# Altium project pajongji_v2.PrjPcb
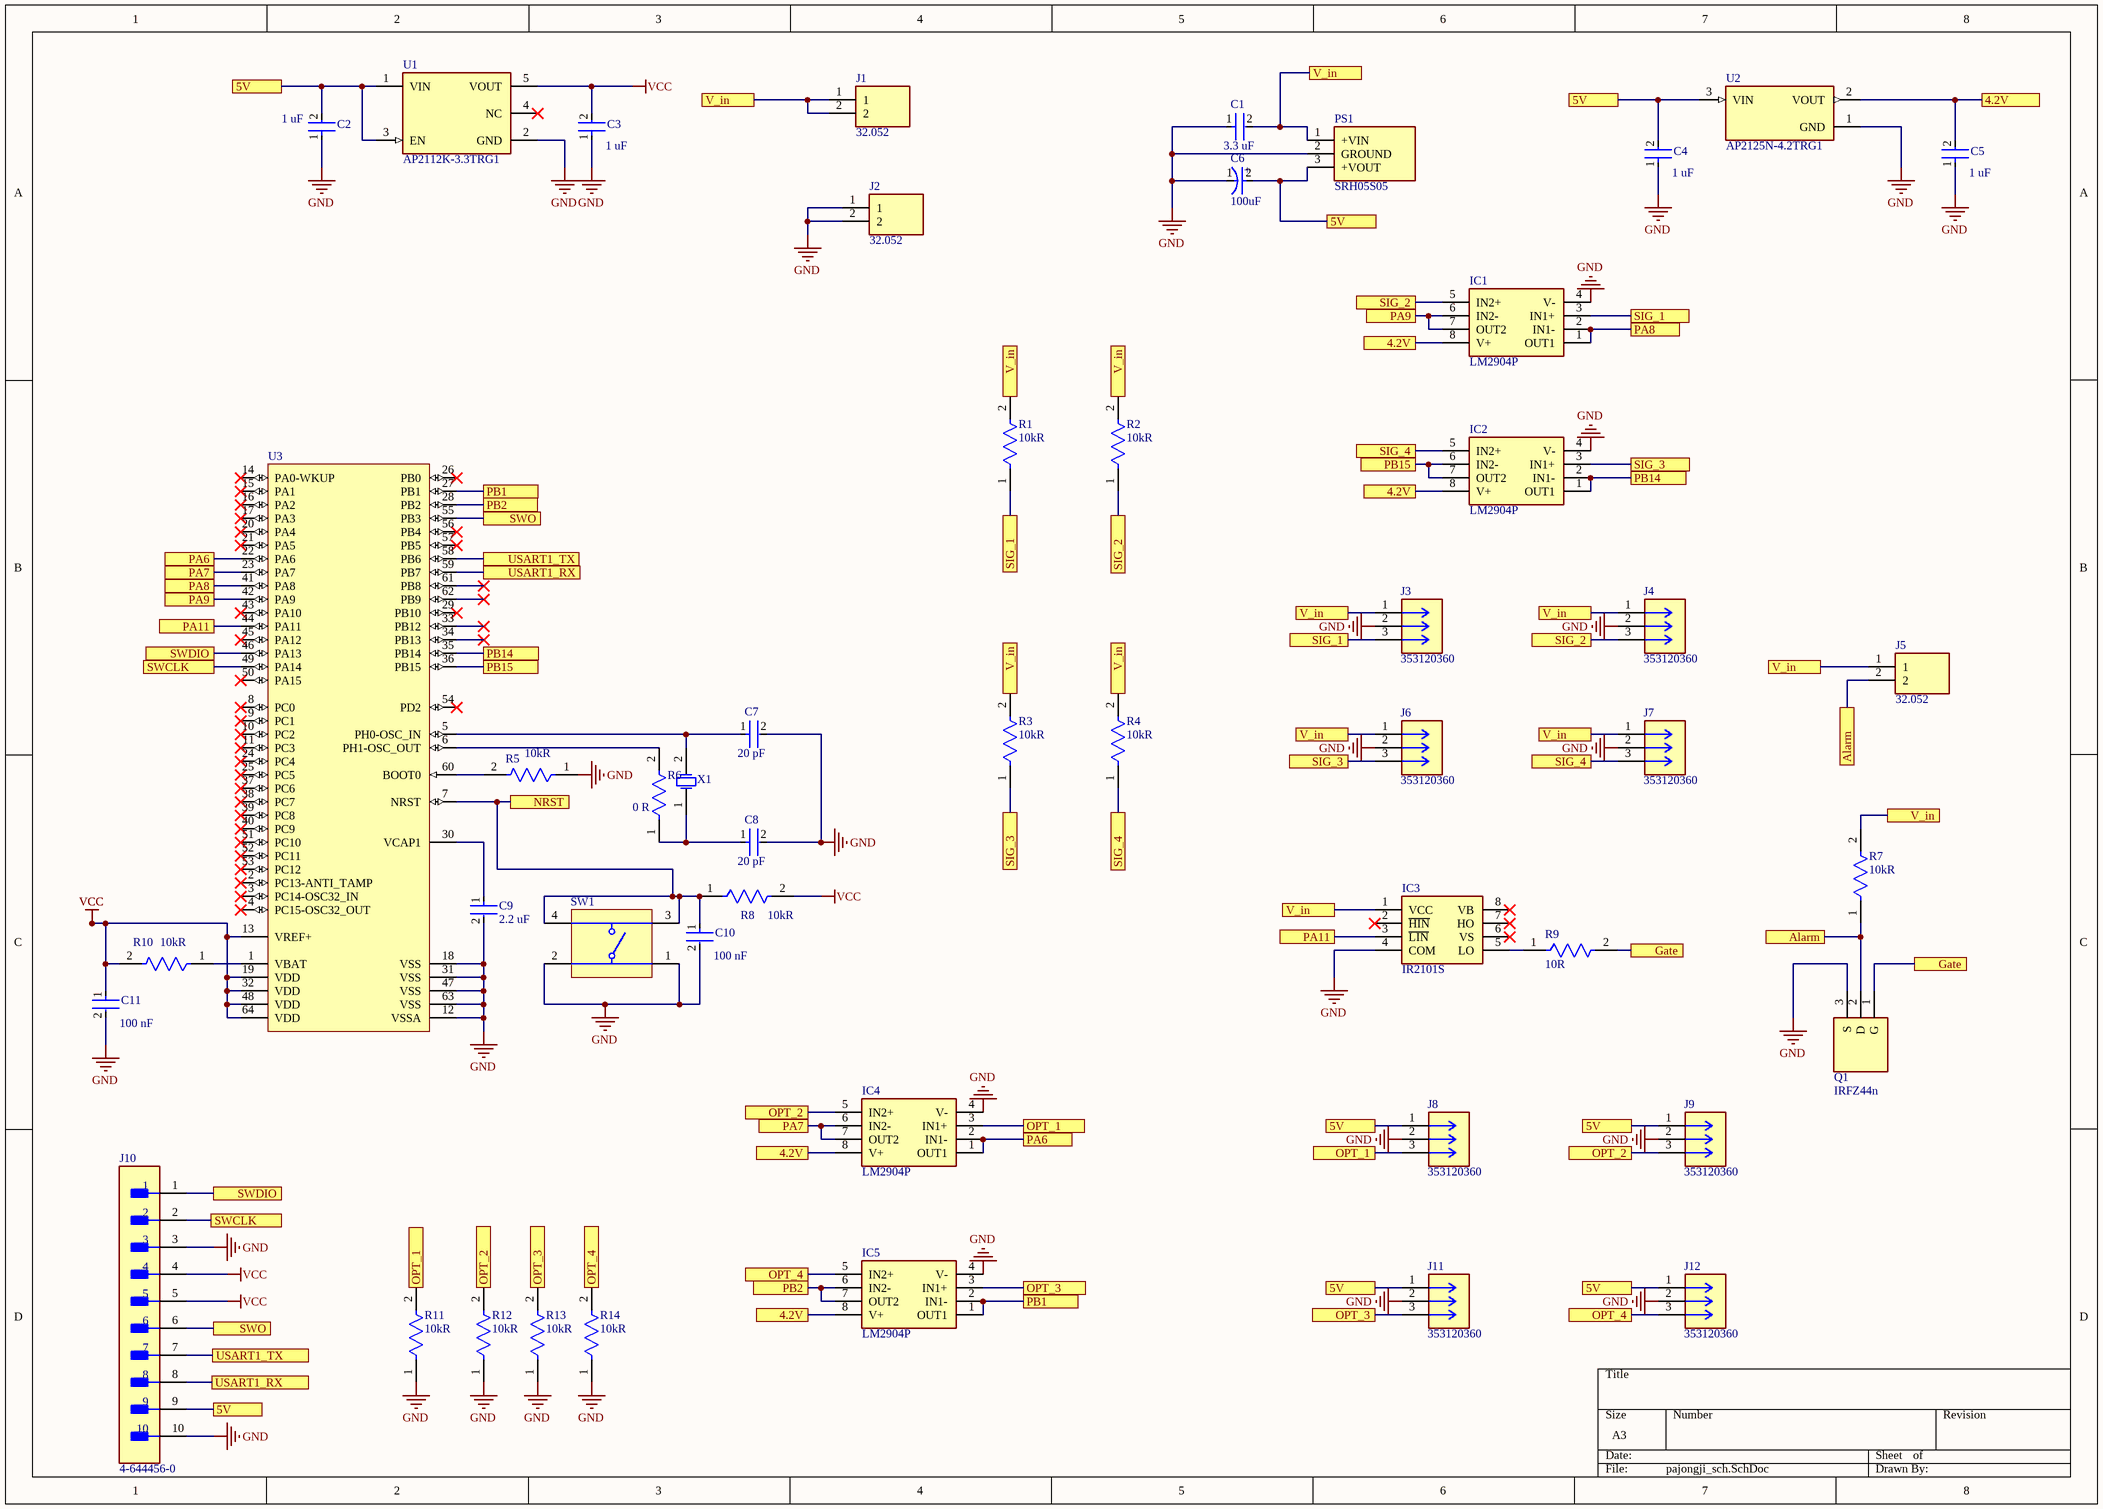
[diagram p0: pajongji_sch.SchDoc]
1 sheet, 49 parts. Net scope: flat (ports and power ports of the same name join across sheets).
Board file: PCB4.PcbDoc

## Sheet pajongji_sch.SchDoc
size A3; SheetNumber: 1; SheetTotal: 1

### Parts
C1  value 3.3 uF  [FP-CC0603-DA-MFG]  (hidden comment: CC0603KRX7R9BB103)
C2  value 1 uF  [FP-CC0603-DA-MFG]  (hidden comment: CC0603KRX7R9BB103)
C3  value 1 uF  [FP-CC0603-DA-MFG]  (hidden comment: CC0603KRX7R9BB103)
C4  value 1 uF  [FP-CC0603-DA-MFG]  (hidden comment: CC0603KRX7R9BB103)
C5  value 1 uF  [FP-CC0603-DA-MFG]  (hidden comment: CC0603KRX7R9BB103)
C6  100uF  [FP-RAD-TH-D_5_0_5-L_11_1-MFG]
C7  value 20 pF  [FP-CC0603-DA-MFG]  (hidden comment: CC0603KRX7R9BB103)
C8  value 20 pF  [FP-CC0603-DA-MFG]  (hidden comment: CC0603KRX7R9BB103)
C9  value 2.2 uF  [FP-CC0603-DA-MFG]  (hidden comment: CC0603KRX7R9BB103)
C10  Capacitance: 100 nF  [FP-CC0603-DA-MFG]  (hidden comment: CC0603KRX7R9BB104)
C11  Capacitance: 100 nF  [FP-CC0603-DA-MFG]  (hidden comment: CC0603KRX7R9BB104)
IC1  LM2904P  [DIP794W53P254L959H508Q8N]
IC2  LM2904P  [DIP794W53P254L959H508Q8N]
IC3  IR2101S  [SOIC127P600X175-8N]
IC4  LM2904P  [DIP794W53P254L959H508Q8N]
IC5  LM2904P  [DIP794W53P254L959H508Q8N]
J1  32.052  [SHDR2W100P0X508_1X2_1076X900X1350P]
J2  32.052  [SHDR2W100P0X508_1X2_1076X900X1350P]
J3  353120360  [CONN_35312-0360_MOL]
J4  353120360  [CONN_35312-0360_MOL]
J5  32.052  [SHDR2W100P0X508_1X2_1076X900X1350P]
J6  353120360  [CONN_35312-0360_MOL]
J7  353120360  [CONN_35312-0360_MOL]
J8  353120360  [CONN_35312-0360_MOL]
J9  353120360  [CONN_35312-0360_MOL]
J10  4-644456-0  [FP-4-644456-0-MFG]
J11  353120360  [CONN_35312-0360_MOL]
J12  353120360  [CONN_35312-0360_MOL]
PS1  SRH05S05  [SRH05S05]
Q1  IRFZ44n  [TO254P483X1016X2223-3P]
R1  Resistance: 10kR  [FP-CR0603-AS-MFG]  (hidden comment: CR0603-FX-1002EAS)
R2  Resistance: 10kR  [FP-CR0603-AS-MFG]  (hidden comment: CR0603-FX-1002EAS)
R3  Resistance: 10kR  [FP-CR0603-AS-MFG]  (hidden comment: CR0603-FX-1002EAS)
R4  Resistance: 10kR  [FP-CR0603-AS-MFG]  (hidden comment: CR0603-FX-1002EAS)
R5  Resistance: 10kR  [FP-CR0603-AS-MFG]  (hidden comment: CR0603-FX-1002EAS)
R6  Resistance: 0 R  [FP-CR0603-AS-MFG]  (hidden comment: CR0603-FX-1002EAS)
R7  Resistance: 10kR  [FP-CR0603-AS-MFG]  (hidden comment: CR0603-FX-1002EAS)
R8  Resistance: 10kR  [FP-CR0603-AS-MFG]  (hidden comment: CR0603-FX-1002EAS)
R9  Resistance: 10R  [FP-CR0603-AS-MFG]  (hidden comment: CR0603-FX-1002EAS)
R10  Resistance: 10kR  [FP-CR0603-AS-MFG]  (hidden comment: CR0603-FX-1002EAS)
R11  Resistance: 10kR  [FP-CR0603-AS-MFG]  (hidden comment: CR0603-FX-1002EAS)
R12  Resistance: 10kR  [FP-CR0603-AS-MFG]  (hidden comment: CR0603-FX-1002EAS)
R13  Resistance: 10kR  [FP-CR0603-AS-MFG]  (hidden comment: CR0603-FX-1002EAS)
R14  Resistance: 10kR  [FP-CR0603-AS-MFG]  (hidden comment: CR0603-FX-1002EAS)
SW1  FSM4JSMATR  [TECO-FSM4JSMATR_V]  (value not drawn)
U1  AP2112K-3.3TRG1  [FP-SOT25-IPC_A]
U2  AP2125N-4.2TRG1  [SOT95P282X145-3N]
U3  STM32F411RET6  [STM-LQFP64_L]  (value not drawn)
X1  FOXSDLF/160-20  [FOX-FOXSDLF160-20_V]  (value not drawn)

### Ports
4.2V (see pajongji_sch[3D], pajongji_sch[6A], pajongji_sch[6B]), 4.2V (see pajongji_sch[3D], pajongji_sch[6A], pajongji_sch[6B], pajongji_sch[8A]), 4.2V (see pajongji_sch[3D], pajongji_sch[6A], pajongji_sch[8A]), 4.2V (see pajongji_sch[3D], pajongji_sch[6B], pajongji_sch[8A]), 5V (see pajongji_sch[1A], pajongji_sch[1D], pajongji_sch[6A], pajongji_sch[6C], pajongji_sch[6D], pajongji_sch[7C]), 5V (see pajongji_sch[1A], pajongji_sch[1D], pajongji_sch[6A], pajongji_sch[6C], pajongji_sch[6D], pajongji_sch[7C], pajongji_sch[7D]), 5V (see pajongji_sch[1A], pajongji_sch[1D], pajongji_sch[6A], pajongji_sch[6C], pajongji_sch[6D], pajongji_sch[7D]), 5V (see pajongji_sch[1A], pajongji_sch[1D], pajongji_sch[6A], pajongji_sch[6C], pajongji_sch[7C], pajongji_sch[7D]), 5V (see pajongji_sch[1A], pajongji_sch[1D], pajongji_sch[6A], pajongji_sch[6D], pajongji_sch[7C], pajongji_sch[7D]), 5V (see pajongji_sch[1A], pajongji_sch[6A], pajongji_sch[6C], pajongji_sch[6D], pajongji_sch[7C], pajongji_sch[7D]), 5V (see pajongji_sch[1D], pajongji_sch[6A], pajongji_sch[6C], pajongji_sch[6D], pajongji_sch[7C], pajongji_sch[7D]), Alarm (see pajongji_sch[7C]), Alarm (see pajongji_sch[8C]), Gate (see pajongji_sch[7C]), Gate (see pajongji_sch[8C]), NRST, OPT_1 (see pajongji_sch[2D], pajongji_sch[4C]), OPT_1 (see pajongji_sch[2D], pajongji_sch[6D]), OPT_1 (see pajongji_sch[4C], pajongji_sch[6D]), OPT_2 (see pajongji_sch[2D], pajongji_sch[3C]), OPT_2 (see pajongji_sch[2D], pajongji_sch[6D]), OPT_2 (see pajongji_sch[3C], pajongji_sch[6D]), OPT_3 (see pajongji_sch[3D], pajongji_sch[4D]), OPT_3 (see pajongji_sch[3D], pajongji_sch[5D]), OPT_3 (see pajongji_sch[4D], pajongji_sch[5D]), OPT_4 (see pajongji_sch[3D]), OPT_4 (see pajongji_sch[3D], pajongji_sch[6D]), PA6 (see pajongji_sch[1B]), PA6 (see pajongji_sch[4D]), PA7 (see pajongji_sch[1B]), PA7 (see pajongji_sch[3C]), PA8 (see pajongji_sch[1B]), PA8 (see pajongji_sch[7A]), PA9 (see pajongji_sch[1B]), PA9 (see pajongji_sch[6A]), PA11 (see pajongji_sch[1B]), PA11 (see pajongji_sch[5C]), PB1 (see pajongji_sch[2B]), PB1 (see pajongji_sch[4D]), PB2 (see pajongji_sch[2B]), PB2 (see pajongji_sch[3D]), PB14 (see pajongji_sch[2B]), PB14 (see pajongji_sch[7B]), PB15 (see pajongji_sch[2B]), PB15 (see pajongji_sch[6B]), SIG_1 (see pajongji_sch[4B], pajongji_sch[5B]), SIG_1 (see pajongji_sch[4B], pajongji_sch[7A]), SIG_1 (see pajongji_sch[5B], pajongji_sch[7A]), SIG_2 (see pajongji_sch[5B], pajongji_sch[6A]), SIG_2 (see pajongji_sch[5B], pajongji_sch[6B]), SIG_2 (see pajongji_sch[6A], pajongji_sch[6B]), SIG_3 (see pajongji_sch[4C], pajongji_sch[5C]), SIG_3 (see pajongji_sch[4C], pajongji_sch[7B]), SIG_3 (see pajongji_sch[5C], pajongji_sch[7B]), SIG_4 (see pajongji_sch[5C], pajongji_sch[6B]), SIG_4 (see pajongji_sch[5C], pajongji_sch[6C]), SIG_4 (see pajongji_sch[6B], pajongji_sch[6C]), SWCLK (see pajongji_sch[1B]), SWCLK (see pajongji_sch[1D]), SWDIO (see pajongji_sch[1B]), SWDIO (see pajongji_sch[1D]), SWO (see pajongji_sch[1D]), SWO (see pajongji_sch[2B]), USART1_RX (see pajongji_sch[1D]), USART1_RX (see pajongji_sch[2B]), USART1_TX (see pajongji_sch[1D]), USART1_TX (see pajongji_sch[2B]), V_in (see pajongji_sch[3A], pajongji_sch[4B], pajongji_sch[5A], pajongji_sch[5B], pajongji_sch[5C], pajongji_sch[6B], pajongji_sch[7B]), V_in (see pajongji_sch[3A], pajongji_sch[4B], pajongji_sch[5A], pajongji_sch[5B], pajongji_sch[5C], pajongji_sch[6B], pajongji_sch[7B], pajongji_sch[8C]), V_in (see pajongji_sch[3A], pajongji_sch[4B], pajongji_sch[5A], pajongji_sch[5B], pajongji_sch[5C], pajongji_sch[6B], pajongji_sch[8C]), V_in (see pajongji_sch[3A], pajongji_sch[4B], pajongji_sch[5A], pajongji_sch[5B], pajongji_sch[6B], pajongji_sch[7B], pajongji_sch[8C]), V_in (see pajongji_sch[3A], pajongji_sch[4B], pajongji_sch[5B], pajongji_sch[5C], pajongji_sch[6B], pajongji_sch[7B], pajongji_sch[8C]), V_in (see pajongji_sch[4B], pajongji_sch[5A], pajongji_sch[5B], pajongji_sch[5C], pajongji_sch[6B], pajongji_sch[7B], pajongji_sch[8C])

### Nets
GND: C1.1 C2.1 C3.1 C4.1 C5.1 C6.1(C) C7.2 C8.2 C9.2 C10.2 C11.2 IC1.4(V-) IC2.4(V-) IC3.4(COM) IC4.4(V-) IC5.4(V-) J2.1 J2.2 J3.2 J4.2 J6.2 J7.2 J8.2 J9.2 J10.3 J10.10 J11.2 J12.2 PS1.2(GROUND) Q1.3(S) R5.1 R11.1 R12.1 R13.1 R14.1 SW1.1 SW1.2 U1.2(GND) U2.1(GND) U3.12(VSSA) U3.18(VSS) U3.31(VSS) U3.47(VSS) U3.63(VSS)
VCC: C3.2 C11.1 J10.4 J10.5 R8.2 R10.2 U1.5(VOUT) U3.13(VREF+) U3.19(VDD) U3.32(VDD) U3.48(VDD) U3.64(VDD)
NetC1_2: C1.2 IC3.1(VCC) J1.1 J1.2 J3.1 J4.1 J5.1 J6.1 J7.1 PS1.1(+VIN) R1.2 R2.2 R3.2 R4.2 R7.2 ; port V_in
NetC2_2: C2.2 C4.2 C6.2(A) J8.1 J9.1 J10.9 J11.1 J12.1 PS1.3(+VOUT) U1.1(VIN) U1.3(EN) U2.3(VIN) ; port 5V
NetC5_2: C5.2 IC1.8(V+) IC2.8(V+) IC4.8(V+) IC5.8(V+) U2.2(VOUT) ; port 4.2V
NetC7_1: C7.1 U3.5(PH0-OSC_IN) X1.2(X2)
NetC8_1: C8.1 R6.1 X1.1(X1)
NetC9_1: C9.1 U3.30(VCAP1)
NetC10_1: C10.1 R8.1 SW1.3 SW1.4 U3.7(NRST) ; port NRST
NetIC1_1: IC1.1(OUT1) IC1.2(IN1-) U3.41(PA8) ; port PA8
NetIC1_3: IC1.3(IN1+) J3.3 R1.1 ; port SIG_1
NetIC1_5: IC1.5(IN2+) J4.3 R2.1 ; port SIG_2
NetIC1_6: IC1.6(IN2-) IC1.7(OUT2) U3.42(PA9) ; port PA9
NetIC2_1: IC2.1(OUT1) IC2.2(IN1-) U3.35(PB14) ; port PB14
NetIC2_3: IC2.3(IN1+) J6.3 R3.1 ; port SIG_3
NetIC2_5: IC2.5(IN2+) J7.3 R4.1 ; port SIG_4
NetIC2_6: IC2.6(IN2-) IC2.7(OUT2) U3.36(PB15) ; port PB15
NetIC3_3: IC3.3(~{LIN}) U3.44(PA11) ; port PA11
NetIC3_5: IC3.5(LO) R9.1
NetIC4_1: IC4.1(OUT1) IC4.2(IN1-) U3.22(PA6) ; port PA6
NetIC4_3: IC4.3(IN1+) J8.3 R11.2 ; port OPT_1
NetIC4_5: IC4.5(IN2+) J9.3 R12.2 ; port OPT_2
NetIC4_6: IC4.6(IN2-) IC4.7(OUT2) U3.23(PA7) ; port PA7
NetIC5_1: IC5.1(OUT1) IC5.2(IN1-) U3.27(PB1) ; port PB1
NetIC5_3: IC5.3(IN1+) J11.3 R13.2 ; port OPT_3
NetIC5_5: IC5.5(IN2+) J12.3 R14.2 ; port OPT_4
NetIC5_6: IC5.6(IN2-) IC5.7(OUT2) U3.28(PB2) ; port PB2
NetJ5_2: J5.2 Q1.2(D) R7.1 ; port Alarm
NetJ10_1: J10.1 U3.46(PA13) ; port SWDIO
NetJ10_2: J10.2 U3.49(PA14) ; port SWCLK
NetJ10_6: J10.6 U3.55(PB3) ; port SWO
NetJ10_7: J10.7 U3.58(PB6) ; port USART1_TX
NetJ10_8: J10.8 U3.59(PB7) ; port USART1_RX
NetQ1_1: Q1.1(G) R9.2 ; port Gate
NetR5_2: R5.2 U3.60(BOOT0)
NetR6_2: R6.2 U3.6(PH1-OSC_OUT)
NetR10_1: R10.1 U3.1(VBAT)

Not connected (* = marked no-connect by the designer): IC3 2(~{HIN})* 6(VS)* 7(HO)* 8(VB)*; U1 4(NC)*; U3 2(PC13-ANTI_TAMP)* 3(PC14-OSC32_IN)* 4(PC15-OSC32_OUT)* 8(PC0)* 9(PC1)* 10(PC2)* 11(PC3)* 14(PA0-WKUP)* 15(PA1)* 16(PA2)* 17(PA3)* 20(PA4)* 21(PA5)* 24(PC4)* 25(PC5)* 26(PB0)* 29(PB10)* 33(PB12)* 34(PB13)* 37(PC6)* 38(PC7)* 39(PC8)* 40(PC9)* 43(PA10)* 45(PA12)* 50(PA15)* 51(PC10)* 52(PC11)* 53(PC12)* 54(PD2)* 56(PB4)* 57(PB5)* 61(PB8)* 62(PB9)*

### Notes on the sheet
- (in symbol CMP-05427-001055-1) +

### Library data of the parts
C1-C5 C7-C9 = CMP-2100-03600-2: CAP CER 10000PF 50V X7R 0603; Manufacturer: YAGEO; Tolerance: 0.1; Material: Ceramic; Temperature Coefficient: 15%; Capacitance: 10 nF; Mouser Description: Multilayer Ceramic Capacitor, CC Series, 0.01 - F, - 10%, X7R, 50 V, 0603 [1608 Metric]; Digikey Description: CAP CER 10000PF 50V X7R 0603; Height: 0.9mm; Category: Cap; Temperature Characteristic: X7R; Footprint Url: http://www.yageo.com/exep/pages/download/literatures/UPY-C_GEN_24.pdf; Lead Free: Yes; Voltage Rating: 50 V; Manufacturer Part Number: CC0603KRX7R9BB103; Temperature: -55°C to +125°C; Device Class L3: Ceramic Capacitors; ComponentLink2Description: Datasheet; Voltage: 50 V; Package: CC0603-DA; Octopart: https://octopart.com/cc0603krx7r9bb103-yageo-192938; Automotive: No; Temperature Range High: +125°C; Temperature Range Low: -55°C; RoHS: TRUE; Device Class L1: Passive Components; ComponentLink2URL: http://www.yageo.com/documents/recent/UPY-GPHC_X7R_6.3V-to-50V_18.pdf; Device Class L2: Capacitors
C6 = CMP-05427-001055-1: Aluminum Electrolytic Capacitors (Radial Lead Type) 33uF ±20% 35V
C10 C11 = CMP-2100-03601-2: CAP CER 0.1UF 50V X7R 0603; Manufacturer: YAGEO; Material: Ceramic; Temperature Coefficient: 15%; Tolerance: 0.1; Value: 100 nF; Height: 0.9mm; Voltage: 50 V; ComponentLink2Description: Datasheet; Device Class L2: Capacitors; Temperature Range High: +125°C; Category: Cap; Footprint Url: http://www.yageo.com/exep/pages/download/literatures/UPY-C_GEN_24.pdf; ComponentLink2URL: http://www.yageo.com/documents/recent/UPY-GPHC_X7R_6.3V-to-50V_18.pdf; Package: CC0603-DA; Temperature: -55°C to +125°C; Voltage Rating: 50 V; Temperature Characteristic: X7R; Device Class L1: Passive Components; Temperature Range Low: -55°C; Manufacturer Part Number: CC0603KRX7R9BB104; RoHS: TRUE; Automotive: No; Device Class L3: Ceramic Capacitors; Octopart: https://octopart.com/cc0603krx7r9bb104-yageo-42244635; Mouser Description: Multilayer Ceramic Capacitor, CC Series, 0.1 - F, - 10%, X7R, 50 V, 0603 [1608 Metric]; Lead Free: Yes; Digikey Description: CAP CER 0.1UF 50V X7R 0603
IC1 IC2 IC4 IC5 = LM2904P: Integrated Circuit; Manufacturer_Name: Texas Instruments; Datasheet Link: http://www.ti.com/lit/ds/symlink/lm2904.pdf; Height: 5.08mm; Manufacturer_Part_Number: LM2904P; Mouser Part Number: 595-LM2904P; Mouser Price/Stock: https://www.mouser.co.uk/ProductDetail/Texas-Instruments/LM2904P?qs=3pnr37ZAbK%252BRjjWgaCXbYA%3D%3D; Arrow Part Number: LM2904P; Arrow Price/Stock: https://www.arrow.com/en/products/lm2904p/texas-instruments?utm_currency=USD&region=europe
IC3 = IR2101S: Integrated Circuit; Manufacturer_Name: Infineon; Datasheet Link: https://pdf1.alldatasheet.com/datasheet-pdf/view/102221/IRF/IR2101S.html; Height: 1.75mm; Manufacturer_Part_Number: IR2101S
J1 J2 J5 = 32.052: Connector; Manufacturer_Name: Altech; Datasheet Link: https://www.mouser.com/datasheet/2/16/PCBUS-32235.pdf; Height: 13.5mm; Manufacturer_Part_Number: 32.052; Mouser Part Number: 845-32.052; Mouser Price/Stock: https://www.mouser.co.uk/ProductDetail/Altech/32.052?qs=3W%2FV3E1N0K7DFKJl2BNhnQ%3D%3D
J10 = CMP-03369-000038-1: CONN HEADER VERT 10POS 2.54MM; Manufacturer: TE Connectivity; Current Rating: 5A; Conn Gender: Male; Number Of Contacts: 10; Conn Orientation: Vertical; Voltage Rating: 250V; Number Of Rows: 1; Device Class L3: unset; Octopart: https://octopart.com/4-644456-0-te+connectivity-39514173; Pitch: 2.54mm; Mouser Description: Headers & Wire Housings NARROW FLT HDR 10P Straight Post; ComponentLink2Description: Datasheet; Height: 0.408inch; Package: 4-644456-0; RoHS: TRUE; Temperature Range High: +105°C; Digikey Description: CONN HEADER VERT 10POS 2.54MM; Temperature: -55°C to +105°C; Device Class L2: Headers and Wire Housings; Automotive: No; Lead Free: Yes; Contact Material: Tin; Manufacturer Part Number: 4-644456-0; Temperature Range Low: -55°C; Footprint Url: https://www.te.com/commerce/DocumentDelivery/DDEController?Action=showdoc&DocId=Customer+Drawing%7F644456%7FD2%7Fpdf%7FEnglish%7FENG_CD_644456_D2.pdf%7F4-644456-0; Device Class L1: Connectors; Category: Conn; ComponentLink2URL: https://www.te.com/commerce/DocumentDelivery/DDEController?Action=showdoc&DocId=Data+Sheet%7F82056_MTA%7F0818%7Fpdf%7FEnglish%7FENG_DS_82056_MTA_0818.pdf%7F4-644456-0
PS1 = SRH05S05: Power Supply; Manufacturer_Name: XP POWER; Datasheet Link: https://componentsearchengine.com/Datasheets/2/SRH05S05.pdf; Height: 10.66mm; Manufacturer_Part_Number: SRH05S05; Mouser Part Number: 209-SRH05S05; Mouser Price/Stock: https://www.mouser.co.uk/ProductDetail/XP-Power/SRH05S05?qs=w%2Fv1CP2dgqqpXLkAz6oqFg%3D%3D
Q1 = IRFZ44n: Transistor; Manufacturer_Name: Infineon; Datasheet Link: http://www.irf.com/product-info/datasheets/data/irfz44n.pdf; Height: 4.83mm; Manufacturer_Part_Number: IRFZ44n; Mouser Part Number: N/A; Mouser Price/Stock: https://www.mouser.co.uk/ProductDetail/Infineon-IR/IRFZ44N?qs=GUK3I%2FECFMgXeaoKiF3JzA%3D%3D
R1-R14 = CMP-07231-000018-1: RES 10K OHM 1% 1/10W 0603; Temperature Coefficient: 100ppm/°C; Max Power Dissipation: 10mW; Max Operating Temperature: 155°C; Number of Terminations: 2; Case Code (Metric): 1608; Composition: Thick Film; Case Code (Imperial): 0603; Min Operating Temperature: -55°C; Case/Package: 0603; Features: Anti-Sulfur; Packaging: Cut Tape; Tolerance: 1%
SW1 = CMP-2000-07486-1: Micro Miniature Push Button Switch FSM JSM, 50 mA, -35 to 85 degC, 4-Pin SMD, RoHS, Tape and Reel; Manufacturer: TE Connectivity; Mechanical Life: 100000Cycles; Current Rating: 50mA; Actuator Material: Polyamide; Max Voltage Rating (DC): 12V; Capacitance: 0f; Illumination Type: Illuminated; Voltage Rating (DC): 24V; Case\/Package: SMD/SMT; Operating Force: 160gf; Contact Resistance: 100mOhm; Actuator Length: 0.055inch; Switch Travel: 0.25mm; Throw Configuration: SPST; Termination: GullWing; Contact Plating: Silver; Orientation: Straight; Mounting Technology: SurfaceMount; REACH SVHC: Unknown; Electrical Life: 100000Cycles; Package Reference: FSM4JSMATR; Max Operating Temperature: 85degC; Manufacturer URL: http://www.te.com/; Package Description: 4-Pin Surface Mount Device, Body 6 x 6 mm, Pitch 4.5 mm; Datasheet Version: Rev. V, 02/2015; Packaging: TapeandReel; Min Operating Temperature: -35degC; Mount: SurfaceMount; Contact Current Rating: 50mA; Contact Material: CopperAlloy; Package Quantity: 1200; Datasheet URL: http://www.te.com/commerce/DocumentDelivery/DDEController?Action=showdoc&DocId=Customer+Drawing%7F2-1437565-7%7FV%7Fpdf%7FEnglish%7FENG_CD_2-1437565-7_V.pdf%7F4-1437565-2; RoHSCompliant: true
U1 = CMP-12756-000035-1: IC REG LINEAR 3.3V 600MA SOT25; Number of Regulators: 1; Output Type: Fixed; Polarity: Positive; Min Input Voltage: 2.5V; Max Input Voltage: 6V; Accuracy: 1.5%; Quiescent Current: 55uA; Dropout Voltage: 250mV; Min Operating Temperature: -40°C; Length: 3.1mm; Output Current: 600mA; Max Operating Temperature: 85°C; Package Quantity: 1; Output Voltage: 3.3V; Width: 1.7mm; Number of Outputs: 1; Packaging: Tape and Reel; Height: 1.3mm; Lead Free: Lead Free; Max Output Current: 600mA; Case/Package: SOT-23-5; Mount: Surface Mount; Number of Pins: 5
U2 = AP2125N-4.2TRG1: Linear Voltage Regulator IC Positive Fixed 1 Output 300mA SOT-23-3; MF: Diodes Inc.; Value: *; SnapEDA_Link: https://www.snapeda.com/parts/AP2125N-4.2TRG1/Diodes+Inc./view-part/?ref=snap; MP: AP2125N-4.2TRG1; Check_prices: https://www.snapeda.com/parts/AP2125N-4.2TRG1/Diodes+Inc./view-part/?ref=eda; Purchase-URL: https://pricing.snapeda.com/search/part/AP2125N-4.2TRG1/?ref=eda; Availability: In Stock; Price: None; Package: SOT-23-3 Diodes Inc.
U3 = CMP-0243-00169-1: ARM Cortex-M4 32-bit MCU+FPU, 512 KB Flash, 128 KB RAM, 50 I/Os, 64-Pin LQFP, -40 to 85 degC, Tray; Operating Frequency(F) (Processor speed) (MHz): 100; FLASH Size (Prog) (kB): 512; Supply Voltage(Vcc) min (V): 1.7; Internal RAM Size (kB): 128; I/Os (High Current): 50; Packing: Tray; ComponentLink1Description: Manufacturer URL; Package Description: LQFP64; DatasheetVersion: Rev. 6; Mounting Technology: Surface Mount; Package Reference: 64-Pin Low-profile Quad Flat Package, Body 10 x 10 mm, Pitch 0.5 mm; ComponentLink2Description: Datasheet; Core: ARM Cortex-M4; ComponentLink2URL: http://www.st.com/st-web-ui/static/active/en/resource/technical/document/datasheet/DM00115249.pdf; ComponentLink1URL: http://www.st.com/
X1 = CMP-1749-00001-1: Resistance Weld SMD Crystal, 16 MHz, +/- 30 ppm, 20 pF, -20 to 70 degC, 2-Pin SMD, RoHS, Tape and Reel; Output Current: 3 mA; Case\Package: SOT-553-6; Min Supply Voltage (DC): 4 V; Max Supply Voltage: 3.3 V; Min Supply Voltage: 1.4 V; Interface: I2C; Max Supply Voltage (DC): 6 V; ComponentLink2Description: Datasheet; REACH SVHC: No SVHC; ComponentLink1URL: http://www.foxonline.com/; ComponentLink2URL: http://foxonline.com/pdfs/hc49sdlf.pdf; Pins: 6; Packaging: Cut Tape; ComponentLink1Description: Manufacturer URL; Weight: 9.9E-05 oz; Length: 1.6 mm; RoHSCompliant: true; Min Operating Temperature: -55 degC; Radiation Hardening: No; PackageDescription: 2-Pin Surface Mount Device, Body 5 x 11.7 mm, Height 4.5 mm; Package Quantity: 1; Width: 1.2 mm; DatasheetVersion: Mar-15; Max Operating Temperature: 150 degC; Mount: Surface Mount; PackageReference: FOX-FOXSDLF160-20; Height: 0.55 mm
J3 J4 J6-J9 J11 J12 = 353120360: Package: None; Price: None; Value: *; MP: 353120360; Availability: Unavailable